# Altium schematic sheet Tray2_Top.SchDoc
size A2
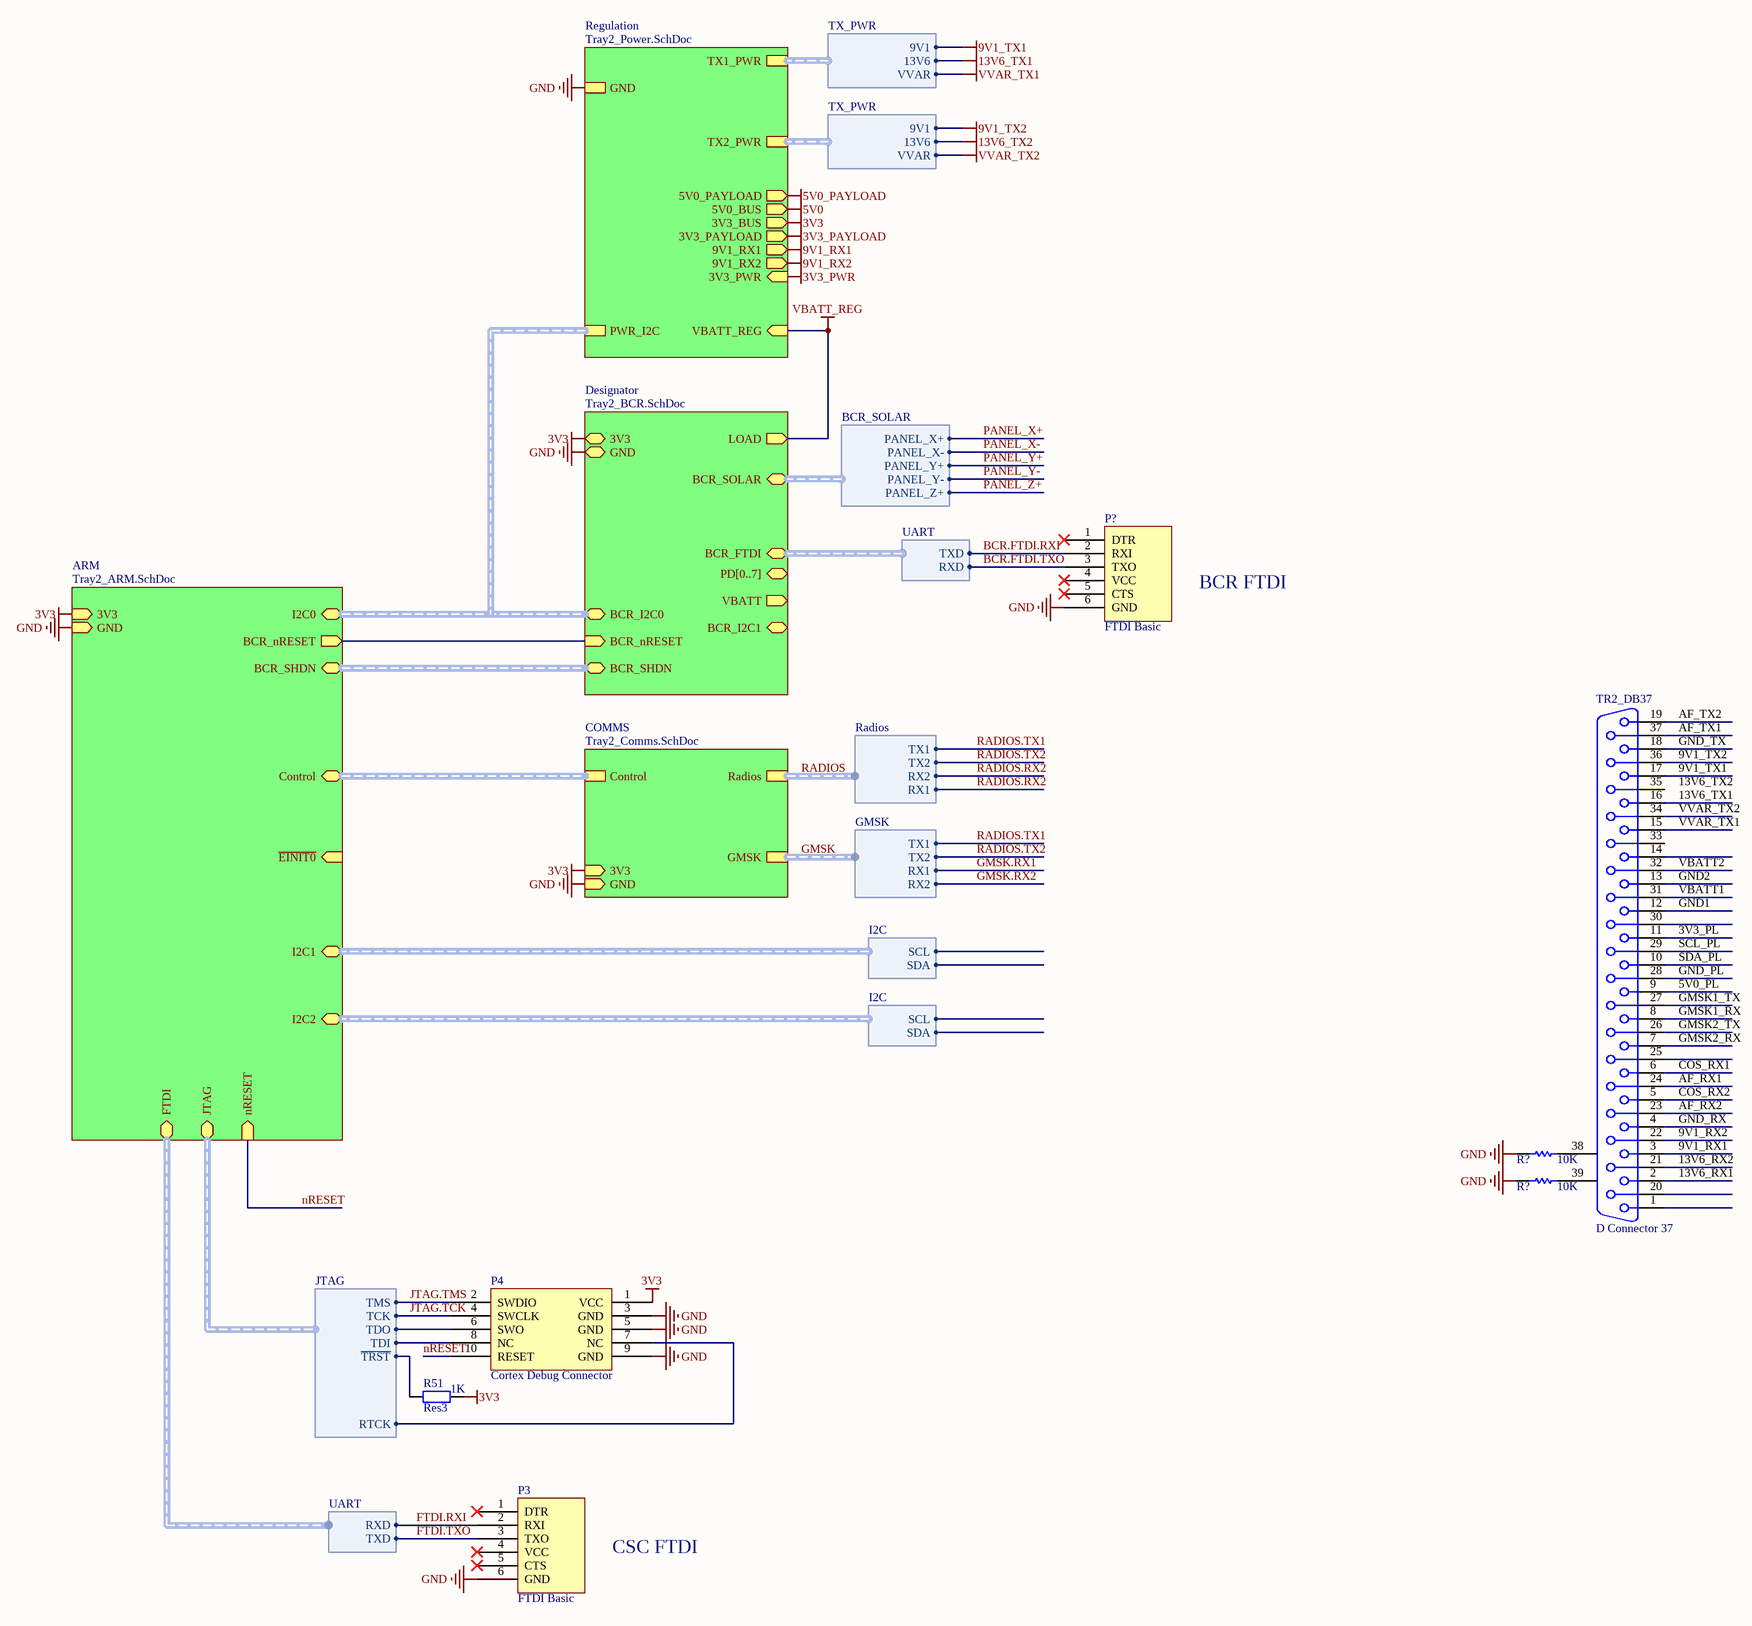
[diagram p0: Tray2_Top.SchDoc]

## Parts
(Parts that share a designator on the sheet are numbered #1, #2 ... from top to bottom, then left to right.)
P3  FTDI Basic  [FTDI BASIC]
P4  Cortex Debug Connector  [FTSH-105-01-L-DV-TR]
P?  FTDI Basic  [FTDI BASIC]
R51  Res3  value 1K  [RESC1005X06L]
R?#1  value 10K  [RESC2012M]  (hidden comment: Res1)
R?#2  value 10K  [RESC2012M]  (hidden comment: Res1)
TR2_DB37  D Connector 37

## Sub-sheets
ARM = Tray2_ARM.SchDoc: ~{EINIT0} (in), nRESET (in), I2C1 (harness I2C), I2C0 (harness I2C), I2C2 (harness I2C), JTAG (harness JTAG), Control (harness CommsControl), FTDI (harness UART), 3V3 (in), GND (in), BCR_SHDN (harness BCR_SHDN), BCR_nRESET (out)
COMMS = Tray2_Comms.SchDoc: GMSK (harness GMSK), Radios (harness Radios), Control (harness CommsControl), 3V3 (in), GND (in)
Designator = Tray2_BCR.SchDoc: LOAD (out), VBATT (out), 3V3, GND, BCR_nRESET (in), BCR_SOLAR (harness BCR_SOLAR), PD[0..7] (bidir), BCR_I2C0 (harness I2C), BCR_I2C1 (harness I2C), BCR_FTDI (harness UART), BCR_SHDN (harness BCR_SHDN)
Regulation = Tray2_Power.SchDoc: 5V0_BUS (out), 3V3_BUS (out), 5V0_PAYLOAD (out), 3V3_PAYLOAD (out), 9V1_RX1 (out), 9V1_RX2 (out), VBATT_REG (in), GND, 3V3_PWR (in), PWR_I2C (harness I2C), TX1_PWR (harness TX_PWR), TX2_PWR (harness TX_PWR)

## Harnesses
TX_PWR: VVAR, 13V6, 9V1
Radios: RX1, RX2, TX1, TX2
GMSK: RX1, RX2, TX1, TX2
I2C: SCL, SDA
BCR_SOLAR: PANEL_X+, PANEL_X-, PANEL_Y+, PANEL_Y-, PANEL_Z+
JTAG: RTCK, ~{TRST}, TCK, TDI, TDO, TMS
UART: RXD, TXD

## Nets
3V3: P4.1(VCC) R51.2 ; sheet ARM/3V3, sheet Regulation/3V3_BUS, sheet Designator/3V3, sheet COMMS/3V3
3V3_PAYLOAD: sheet Regulation/3V3_PAYLOAD
3V3_PWR: sheet Regulation/3V3_PWR
5V0: sheet Regulation/5V0_BUS
5V0_PAYLOAD: sheet Regulation/5V0_PAYLOAD
9V1_RX1: TR2_DB37.3 ; sheet Regulation/9V1_RX1
9V1_RX2: TR2_DB37.22 ; sheet Regulation/9V1_RX2
9V1_TX1: TR2_DB37.17 ; sheet Regulation/TX1_PWR.9V1
9V1_TX2: TR2_DB37.36 ; sheet Regulation/TX2_PWR.9V1
13V6_TX1: TR2_DB37.16 ; sheet Regulation/TX1_PWR.13V6
13V6_TX2: sheet Regulation/TX2_PWR.13V6
GND: P3.6(GND) P4.3(GND) P4.5(GND) P4.9(GND) P?.6(GND) R?#1.1 R?#2.1 ; sheet ARM/GND, sheet Regulation/GND, sheet Designator/GND, sheet COMMS/GND
VBATT_REG: sheet Regulation/VBATT_REG, sheet Designator/LOAD
VVAR_TX1: TR2_DB37.15 ; sheet Regulation/TX1_PWR.VVAR
VVAR_TX2: TR2_DB37.34 ; sheet Regulation/TX2_PWR.VVAR
3V3_PL: TR2_DB37.11
5V0_PL: TR2_DB37.9
13V6_RX1: TR2_DB37.2
13V6_RX2: TR2_DB37.21
AF_RX1: TR2_DB37.24
AF_RX2: TR2_DB37.23
AF_TX1: TR2_DB37.37
AF_TX2: TR2_DB37.19
BCR.FTDI.RXI: P?.2(RXI) ; sheet Designator/BCR_FTDI.TXD
BCR.FTDI.TXO: P?.3(TXO) ; sheet Designator/BCR_FTDI.RXD
COS_RX1: TR2_DB37.6
COS_RX2: TR2_DB37.5
FTDI.RXI: P3.2(RXI) ; sheet ARM/FTDI.RXD
FTDI.TXO: P3.3(TXO) ; sheet ARM/FTDI.TXD
GMSK1_RX: TR2_DB37.8
GMSK1_TX: TR2_DB37.27
GMSK2_RX: TR2_DB37.7
GMSK2_TX: TR2_DB37.26
GMSK.RX1: sheet COMMS/GMSK.RX1
GMSK.RX2: sheet COMMS/GMSK.RX2
GND1: TR2_DB37.12
GND2: TR2_DB37.13
GND_PL: TR2_DB37.28
GND_RX: TR2_DB37.4
GND_TX: TR2_DB37.18
JTAG.TCK: P4.4(SWCLK) ; sheet ARM/JTAG.TCK
JTAG.TMS: P4.2(SWDIO) ; sheet ARM/JTAG.TMS
nRESET: P4.10(RESET) ; sheet ARM/nRESET
PANEL_X+: sheet Designator/BCR_SOLAR.PANEL_X+
PANEL_X-: sheet Designator/BCR_SOLAR.PANEL_X-
PANEL_Y+: sheet Designator/BCR_SOLAR.PANEL_Y+
PANEL_Y-: sheet Designator/BCR_SOLAR.PANEL_Y-
PANEL_Z+: sheet Designator/BCR_SOLAR.PANEL_Z+
RADIOS.RX2: sheet COMMS/Radios.RX1, sheet COMMS/Radios.RX2  [project net RADIOS.RX1]
RADIOS.TX1: sheet COMMS/Radios.TX1, sheet COMMS/GMSK.TX1  [project net GMSK.TX1]
RADIOS.TX2: sheet COMMS/Radios.TX2, sheet COMMS/GMSK.TX2  [project net GMSK.TX2]
SCL_PL: TR2_DB37.29
SDA_PL: TR2_DB37.10
VBATT1: TR2_DB37.31
VBATT2: TR2_DB37.32
NetP4_6: P4.6(SWO) ; sheet ARM/JTAG.TDO
NetP4_7: P4.7(NC) ; sheet ARM/JTAG.RTCK
NetP4_8: P4.8(NC) ; sheet ARM/JTAG.TDI
NetR51_1: R51.1 ; sheet ARM/JTAG.~{TRST}
NetR?#1_2: R?#1.2 TR2_DB37.38(MH1)
NetR?#2_2: R?#2.2 TR2_DB37.39(MH2)
(unnamed): sheet ARM/BCR_nRESET, sheet Designator/BCR_nRESET

Not connected (* = marked no-connect by the designer): P3 1(DTR)* 4(VCC)* 5(CTS)*; P? 1(DTR)* 4(VCC)* 5(CTS)*; TR2_DB37 1 14 20 25 30 33 35

## Buses and harness runs
harness GMSK = sheet COMMS/GMSK
harness RADIOS = sheet COMMS/Radios
harness sheet ARM/BCR_SHDN = sheet Designator/BCR_SHDN
harness sheet ARM/Control = sheet COMMS/Control
harness sheet ARM/I2C0 = sheet Designator/BCR_I2C0 = sheet Regulation/PWR_I2C

## Notes on the sheet
- BCR FTDI
- CSC FTDI
- Labels drawn without touching a wire or pin: 13V6_TX2

## Library data of the parts
P4 = Cortex Debug Connector: Mates with FFSD-05-D-12.00-01-N
R51 = Res3: Resistor; Published: 8-Jun-2000; LatestRevisionDate: 29-May-2009; LatestRevisionNote: IPC-7351 Footprint Added.; PackageReference: J1-0603; Publisher: Altium Limited; PackageDescription: Chip Resistor
R?#1 R?#2 = Res1: Resistor; Published: 8-Jun-2000; LatestRevisionDate: 17-Jul-2002; LatestRevisionNote: Re-released for DXP Platform.; PackageReference: AXIAL-0.3; Publisher: Altium Limited; PackageDescription: Axial Device, Thru-Hole; 2 Leads; 0.3 in Pin Spacing; Supplier 1: Farnell
TR2_DB37 = D Connector 37: Receptacle Assembly, 37 Position, Right Angle; PackageDocument: U; Positions: 25; Published: 15-Jun-2001; LatestRevisionDate: 17-Jul-2002; LatestRevisionNote: Re-released for DXP Platform.; DatasheetDocument: 19-Mar-1999; PackageReference: 787202; Publisher: Altium Limited; Orientation: Right Angle; Gender: Receptacle